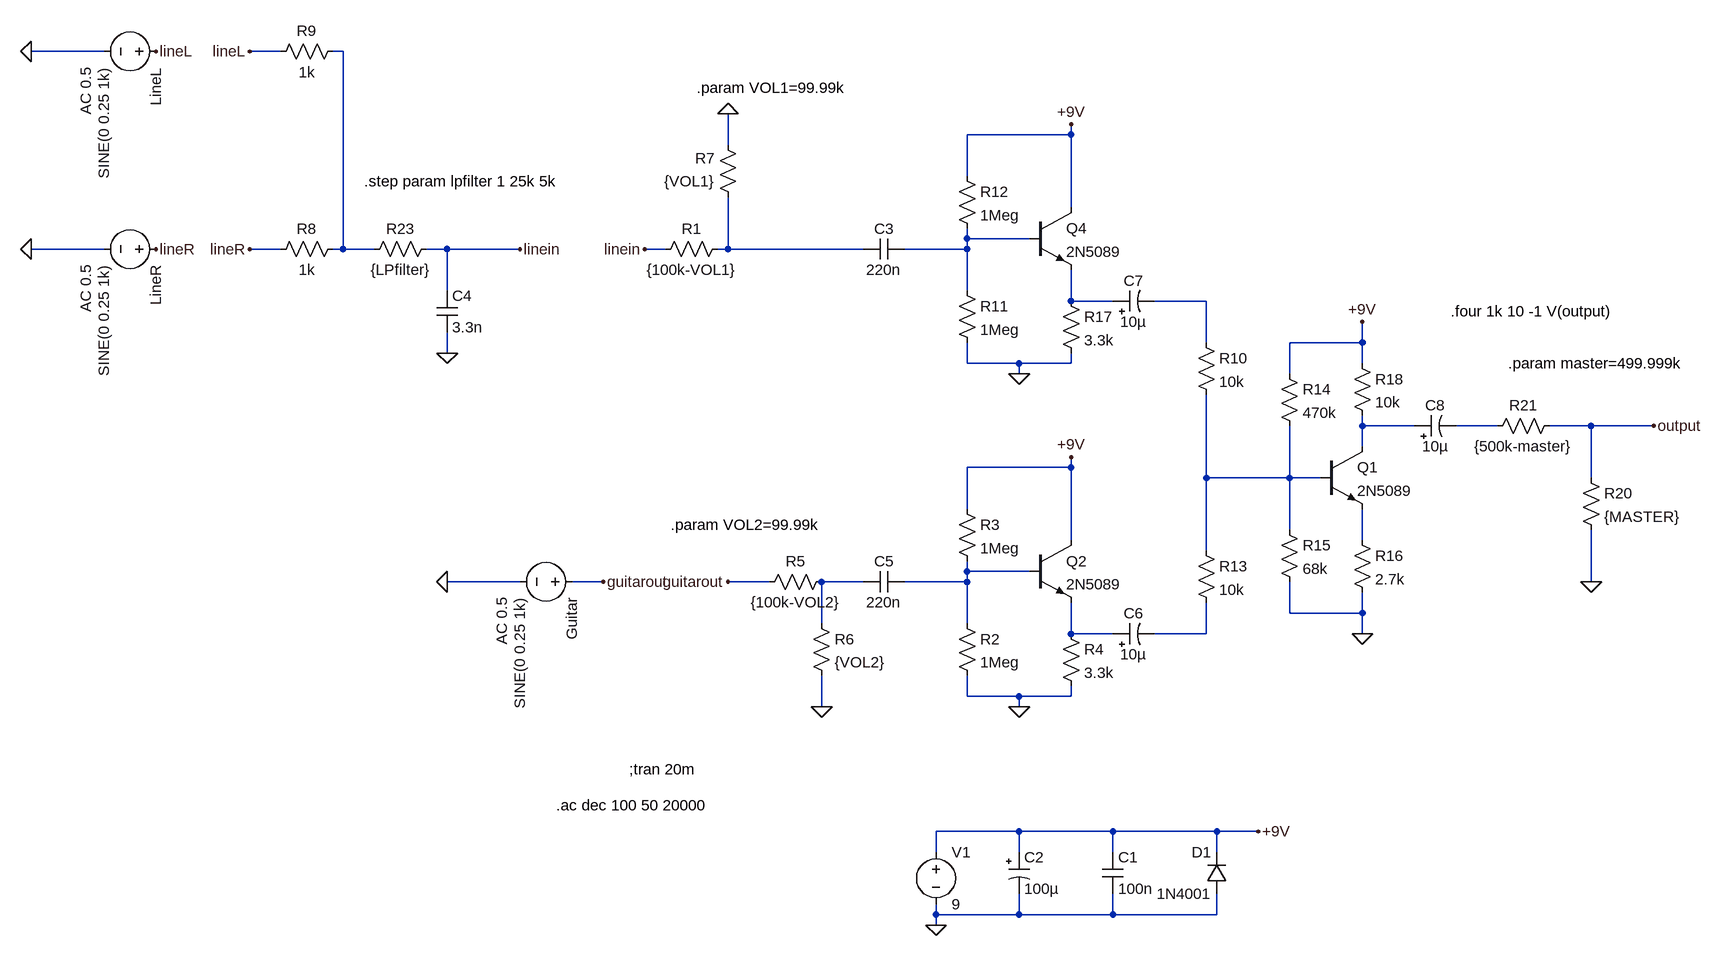
[diagram p0: schematic schematic_bjt.asc]
schematic_bjt.asc, the LTspice schematic file:
Version 4
SHEET 1 1572 708
WIRE -2000 -656 -2112 -656
WIRE -1728 -656 -1776 -656
WIRE -1632 -656 -1648 -656
WIRE -512 -528 -512 -544
WIRE -512 -528 -672 -528
WIRE -1040 -512 -1040 -560
WIRE -672 -464 -672 -528
WIRE -512 -416 -512 -528
WIRE -672 -368 -672 -384
WIRE -576 -368 -672 -368
WIRE -2000 -352 -2112 -352
WIRE -1728 -352 -1776 -352
WIRE -1632 -352 -1632 -656
WIRE -1632 -352 -1648 -352
WIRE -1584 -352 -1632 -352
WIRE -1472 -352 -1504 -352
WIRE -1360 -352 -1472 -352
WIRE -1136 -352 -1168 -352
WIRE -1040 -352 -1040 -432
WIRE -1040 -352 -1056 -352
WIRE -832 -352 -1040 -352
WIRE -672 -352 -672 -368
WIRE -672 -352 -768 -352
WIRE -1472 -288 -1472 -352
WIRE -672 -288 -672 -352
WIRE -512 -272 -512 -320
WIRE -448 -272 -512 -272
WIRE -304 -272 -384 -272
WIRE -304 -208 -304 -272
WIRE -64 -208 -64 -240
WIRE -64 -208 -176 -208
WIRE -1472 -192 -1472 -224
WIRE -672 -176 -672 -208
WIRE -592 -176 -672 -176
WIRE -512 -176 -512 -192
WIRE -512 -176 -592 -176
WIRE -64 -176 -64 -208
WIRE -592 -160 -592 -176
WIRE -176 -160 -176 -208
WIRE -64 -80 -64 -96
WIRE 16 -80 -64 -80
WIRE 144 -80 80 -80
WIRE 288 -80 224 -80
WIRE 384 -80 288 -80
WIRE -64 -48 -64 -80
WIRE -512 -16 -512 -32
WIRE -512 -16 -672 -16
WIRE -304 0 -304 -128
WIRE -176 0 -176 -80
WIRE -176 0 -304 0
WIRE -128 0 -176 0
WIRE 288 0 288 -80
WIRE -672 48 -672 -16
WIRE -176 80 -176 0
WIRE -512 96 -512 -16
WIRE -64 96 -64 48
WIRE -304 112 -304 0
WIRE -672 144 -672 128
WIRE -576 144 -672 144
WIRE -1360 160 -1472 160
WIRE -1232 160 -1280 160
WIRE -976 160 -1040 160
WIRE -832 160 -896 160
WIRE -672 160 -672 144
WIRE -672 160 -768 160
WIRE 288 160 288 80
WIRE -176 208 -176 160
WIRE -64 208 -64 176
WIRE -64 208 -176 208
WIRE -896 224 -896 160
WIRE -672 224 -672 160
WIRE -512 240 -512 192
WIRE -448 240 -512 240
WIRE -304 240 -304 192
WIRE -304 240 -384 240
WIRE -64 240 -64 208
WIRE -672 336 -672 304
WIRE -592 336 -672 336
WIRE -512 336 -512 320
WIRE -512 336 -592 336
WIRE -896 352 -896 304
WIRE -592 352 -592 336
WIRE -592 544 -720 544
WIRE -448 544 -592 544
WIRE -288 544 -448 544
WIRE -224 544 -288 544
WIRE -720 576 -720 544
WIRE -592 576 -592 544
WIRE -448 576 -448 544
WIRE -288 576 -288 544
WIRE -720 672 -720 656
WIRE -592 672 -592 640
WIRE -592 672 -720 672
WIRE -448 672 -448 640
WIRE -448 672 -592 672
WIRE -288 672 -288 640
WIRE -288 672 -448 672
WIRE -720 688 -720 672
FLAG -720 688 0
FLAG -1472 160 0
FLAG -224 544 +9V
FLAG -2112 -656 0
FLAG -2112 -352 0
FLAG -1776 -656 lineL
FLAG -1920 -656 lineL
FLAG -1776 -352 lineR
FLAG -1920 -352 lineR
FLAG -592 352 0
FLAG -512 -32 +9V
FLAG -1040 160 guitarout
FLAG -896 352 0
FLAG -1040 -560 0
FLAG -592 -160 0
FLAG -512 -544 +9V
FLAG -1168 -352 linein
FLAG -1360 -352 linein
FLAG 288 160 0
FLAG 384 -80 output
FLAG -64 240 0
FLAG -64 -240 +9V
FLAG -1232 160 guitarout
FLAG -1472 -192 0
SYMBOL voltage -720 560 R0
WINDOW 123 0 0 Left 0
WINDOW 39 0 0 Left 0
SYMATTR InstName V1
SYMATTR Value 9
SYMBOL voltage -1904 -352 R90
WINDOW 123 24 124 Left 2
WINDOW 39 0 0 Left 0
SYMATTR Value2 AC 0.5
SYMATTR InstName LineR
SYMATTR Value SINE(0 0.25 1k)
SYMBOL voltage -1264 160 R90
WINDOW 123 24 124 Left 2
WINDOW 39 0 0 Left 0
SYMATTR Value2 AC 0.5
SYMATTR InstName Guitar
SYMATTR Value SINE(0 0.25 1k)
SYMBOL voltage -1904 -656 R90
WINDOW 123 24 124 Left 2
WINDOW 39 0 0 Left 0
SYMATTR Value2 AC 0.5
SYMATTR InstName LineL
SYMATTR Value SINE(0 0.25 1k)
SYMBOL res -1632 -368 R90
WINDOW 0 0 56 VBottom 2
WINDOW 3 32 56 VTop 2
SYMATTR InstName R8
SYMATTR Value 1k
SYMBOL res -1632 -672 R90
WINDOW 0 0 56 VBottom 2
WINDOW 3 32 56 VTop 2
SYMATTR InstName R9
SYMATTR Value 1k
SYMBOL polcap -608 576 R0
SYMATTR InstName C2
SYMATTR Value 100µ
SYMATTR Description Capacitor
SYMATTR Type cap
SYMATTR SpiceLine V=50 Irms=13m Rser=2.33635 Lser=3.37736n
SYMBOL diode -272 640 R180
WINDOW 0 24 64 Left 2
WINDOW 3 24 0 Left 2
SYMATTR InstName D1
SYMATTR Value 1N4001
SYMBOL res -688 208 R0
SYMATTR InstName R2
SYMATTR Value 1Meg
SYMBOL res -688 32 R0
SYMATTR InstName R3
SYMATTR Value 1Meg
SYMBOL cap -768 144 R90
WINDOW 0 0 32 VBottom 2
WINDOW 3 32 32 VTop 2
SYMATTR InstName C5
SYMATTR Value 220n
SYMBOL polcap -448 256 R270
WINDOW 0 32 32 VTop 2
WINDOW 3 0 32 VBottom 2
SYMATTR InstName C6
SYMATTR Value 10µ
SYMATTR Description Capacitor
SYMATTR Type cap
SYMATTR SpiceLine V=50 Irms=13m Rser=2.33635 Lser=3.37736n
SYMBOL res -528 224 R0
SYMATTR InstName R4
SYMATTR Value 3.3k
SYMBOL res -912 208 R0
SYMATTR InstName R6
SYMATTR Value {VOL2}
SYMBOL res -1024 -416 R180
WINDOW 0 36 76 Left 2
WINDOW 3 36 40 Left 2
SYMATTR InstName R7
SYMATTR Value {VOL1}
SYMBOL res -688 -304 R0
SYMATTR InstName R11
SYMATTR Value 1Meg
SYMBOL res -688 -480 R0
SYMATTR InstName R12
SYMATTR Value 1Meg
SYMBOL cap -768 -368 R90
WINDOW 0 0 32 VBottom 2
WINDOW 3 32 32 VTop 2
SYMATTR InstName C3
SYMATTR Value 220n
SYMBOL polcap -448 -256 R270
WINDOW 0 32 32 VTop 2
WINDOW 3 0 32 VBottom 2
SYMATTR InstName C7
SYMATTR Value 10µ
SYMATTR Description Capacitor
SYMATTR Type cap
SYMATTR SpiceLine V=50 Irms=13m Rser=2.33635 Lser=3.37736n
SYMBOL res -528 -288 R0
SYMATTR InstName R17
SYMATTR Value 3.3k
SYMBOL npn -576 96 R0
SYMATTR InstName Q2
SYMATTR Value 2N5089
SYMBOL npn -576 -416 R0
SYMATTR InstName Q4
SYMATTR Value 2N5089
SYMBOL res -1040 -368 R90
WINDOW 0 0 56 VBottom 2
WINDOW 3 32 56 VTop 2
SYMATTR InstName R1
SYMATTR Value {100k-VOL1}
SYMBOL res -880 144 R90
WINDOW 0 0 56 VBottom 2
WINDOW 3 32 56 VTop 2
SYMATTR InstName R5
SYMATTR Value {100k-VOL2}
SYMBOL cap -464 576 R0
SYMATTR InstName C1
SYMATTR Value 100n
SYMBOL res 272 -16 R0
SYMATTR InstName R20
SYMATTR Value {MASTER}
SYMBOL res 240 -96 R90
WINDOW 0 0 56 VBottom 2
WINDOW 3 32 56 VTop 2
SYMATTR InstName R21
SYMATTR Value {500k-master}
SYMBOL res -320 -224 R0
SYMATTR InstName R10
SYMATTR Value 10k
SYMBOL res -320 96 R0
SYMATTR InstName R13
SYMATTR Value 10k
SYMBOL npn -128 -48 R0
SYMATTR InstName Q1
SYMATTR Value 2N5089
SYMBOL res -192 -176 R0
SYMATTR InstName R14
SYMATTR Value 470k
SYMBOL res -192 64 R0
SYMATTR InstName R15
SYMATTR Value 68k
SYMBOL res -80 80 R0
SYMATTR InstName R16
SYMATTR Value 2.7k
SYMBOL res -80 -192 R0
SYMATTR InstName R18
SYMATTR Value 10k
SYMBOL polcap 16 -64 R270
WINDOW 0 32 32 VTop 2
WINDOW 3 0 32 VBottom 2
SYMATTR InstName C8
SYMATTR Value 10µ
SYMATTR Description Capacitor
SYMATTR Type cap
SYMATTR SpiceLine V=50 Irms=13m Rser=2.33635 Lser=3.37736n
SYMBOL cap -1488 -288 R0
SYMATTR InstName C4
SYMATTR Value 3.3n
SYMBOL res -1488 -368 R90
WINDOW 0 0 56 VBottom 2
WINDOW 3 32 56 VTop 2
SYMATTR InstName R23
SYMATTR Value {LPfilter}
TEXT -1192 448 Left 2 !;tran 20m
TEXT -1304 504 Left 2 !.ac dec 100 50 20000
TEXT -1088 -600 Left 2 !.param VOL1=99.99k
TEXT -1128 72 Left 2 !.param VOL2=99.99k
TEXT 160 -176 Left 2 !.param master=499.999k
TEXT 72 -256 Left 2 !.four 1k 10 -1 V(output)
TEXT -1600 -456 Left 2 !.step param lpfilter 1 25k 5k

The netlist it stands for:
* schematic_bjt.asc
V1 +9V 0 9
V§LineR lineR 0 SINE(0 0.25 1k) AC 0.5
V§Guitar guitarout 0 SINE(0 0.25 1k) AC 0.5
V§LineL lineL 0 SINE(0 0.25 1k) AC 0.5
R8 N001 lineR 1k
R9 N001 lineL 1k
C2 +9V 0 100µ V=50 Irms=13m Rser=2.33635 Lser=3.37736n
D1 0 +9V 1N4001
R2 N010 0 1Meg
R3 +9V N010 1Meg
C5 N010 N011 220n
C6 N012 N013 10µ V=50 Irms=13m Rser=2.33635 Lser=3.37736n
R4 N012 0 3.3k
R6 N011 0 {VOL2}
R7 N003 0 {VOL1}
R11 N002 0 1Meg
R12 +9V N002 1Meg
C3 N002 N003 220n
C7 N004 N005 10µ V=50 Irms=13m Rser=2.33635 Lser=3.37736n
R17 N004 0 3.3k
Q2 +9V N010 N012 0 2N5089
Q4 +9V N002 N004 0 2N5089
R1 N003 linein {100k-VOL1}
R5 N011 guitarout {100k-VOL2}
C1 +9V 0 100n
R20 output 0 {MASTER}
R21 output N007 {500k-master}
R10 N005 N008 10k
R13 N008 N013 10k
Q1 N006 N008 N009 0 2N5089
R14 +9V N008 470k
R15 N008 0 68k
R16 N009 0 2.7k
R18 +9V N006 10k
C8 N006 N007 10µ V=50 Irms=13m Rser=2.33635 Lser=3.37736n
C4 linein 0 3.3n
R23 linein N001 {LPfilter}
.model D D
.lib standard.dio
.model NPN NPN
.model PNP PNP
.lib standard.bjt
;tran 20m
.ac dec 100 50 20000
.param VOL1=99.99k
.param VOL2=99.99k
.param master=499.999k
.four 1k 10 -1 V(output)
.step param lpfilter 1 25k 5k
.backanno
.end